# Altium schematic sheet STM32H745.SchDoc
size A
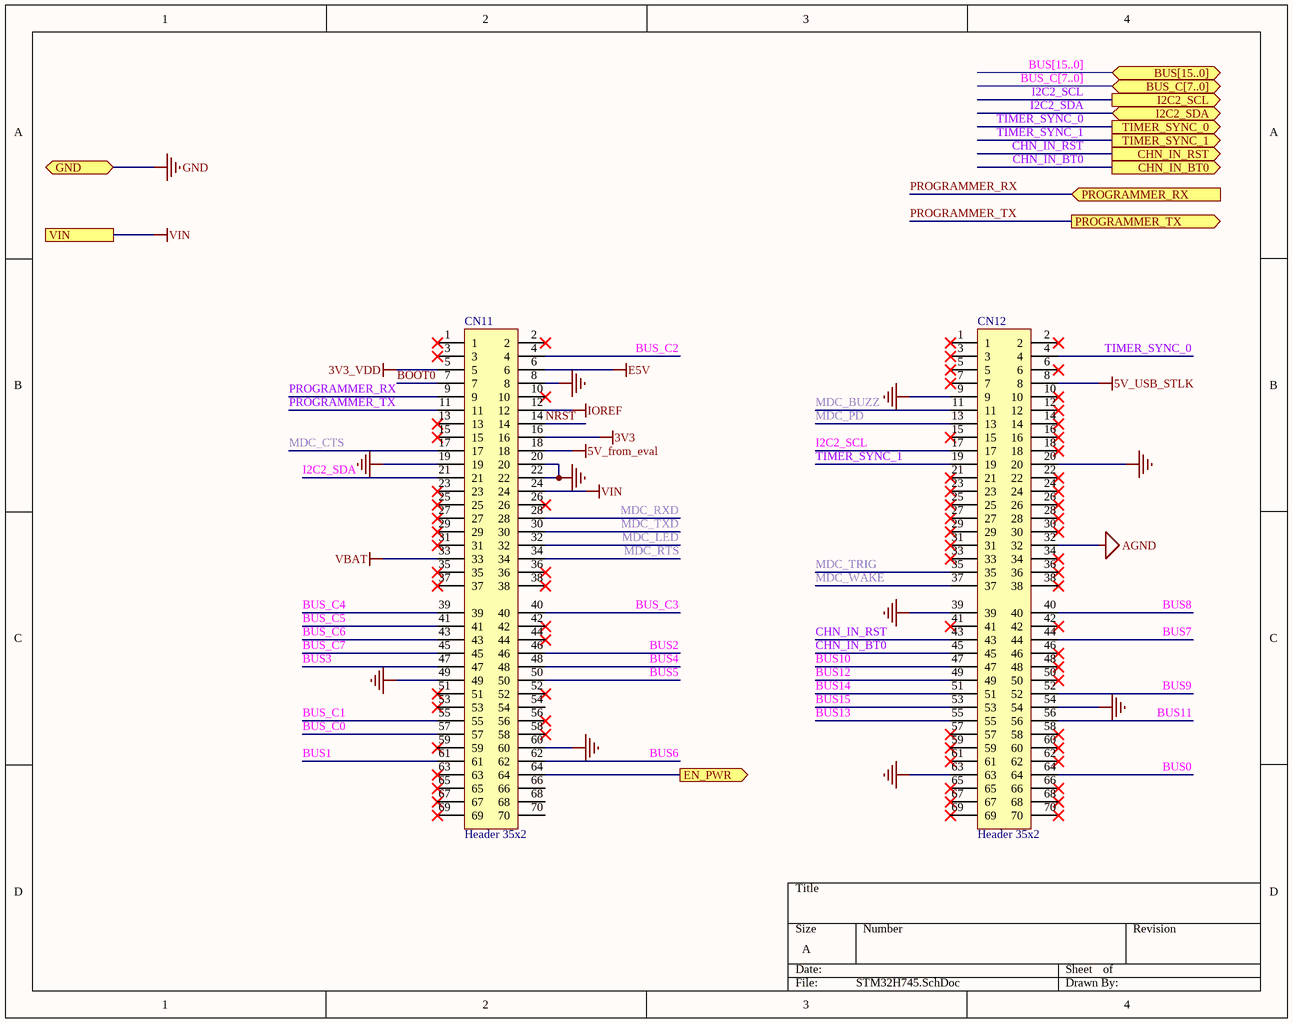
[diagram p0: STM32H745.SchDoc]

## Parts
CN11  Header 35x2  [HDR_2x36_2R54_V_M]
CN12  Header 35x2  [HDR_2x36_2R54_V_M]

## Ports
BUS[15..0] (bidir), BUS_C[7..0] (bidir), CHN_IN_BT0 (out), CHN_IN_RST (out), EN_PWR (out), GND (bidir), I2C2_SCL (out), I2C2_SDA (bidir), PROGRAMMER_RX (in), PROGRAMMER_TX (out), TIMER_SYNC_0 (out), TIMER_SYNC_1 (out), VIN

## Nets
3V3: CN11.16
3V3_VDD: CN11.5
5V_from_eval: CN11.18
5V_USB_STLK: CN12.8
AGND: CN12.32
E5V: CN11.6
GND: CN11.8 CN11.19 CN11.20 CN11.22 CN11.49 CN11.60 CN12.9 CN12.20 CN12.39 CN12.54 CN12.63 ; port GND
IOREF: CN11.12
VBAT: CN11.33
VIN: CN11.24 ; port VIN
BOOT0: CN11.7
BUS0: CN12.64
BUS1: CN11.61
BUS2: CN11.46
BUS3: CN11.47
BUS4: CN11.48
BUS5: CN11.50
BUS6: CN11.62
BUS7: CN12.44
BUS8: CN12.40
BUS9: CN12.52
BUS10: CN12.47
BUS11: CN12.56
BUS12: CN12.49
BUS13: CN12.55
BUS14: CN12.51
BUS15: CN12.53
BUS_C0: CN11.57
BUS_C1: CN11.55
BUS_C2: CN11.4
BUS_C3: CN11.40
BUS_C4: CN11.39
BUS_C5: CN11.41
BUS_C6: CN11.43
BUS_C7: CN11.45
CHN_IN_BT0: CN12.45 ; port CHN_IN_BT0
CHN_IN_RST: CN12.43 ; port CHN_IN_RST
EN_PWR: CN11.64 ; port EN_PWR
I2C2_SCL: CN12.17 ; port I2C2_SCL
I2C2_SDA: CN11.21 ; port I2C2_SDA
MDC_BUZZ: CN12.11
MDC_CTS: CN11.17
MDC_LED: CN11.32
MDC_PD: CN12.13
MDC_RTS: CN11.34
MDC_RXD: CN11.28
MDC_TRIG: CN12.35
MDC_TXD: CN11.30
MDC_WAKE: CN12.37
NRST: CN11.14
PROGRAMMER_RX: CN11.9 ; port PROGRAMMER_RX
PROGRAMMER_TX: CN11.11 ; port PROGRAMMER_TX
TIMER_SYNC_0: CN12.4 ; port TIMER_SYNC_0
TIMER_SYNC_1: CN12.19 ; port TIMER_SYNC_1

Not connected (* = marked no-connect by the designer): CN11 1* 2* 3* 10* 13* 15* 23* 25* 26* 27* 29* 31* 35* 36* 37* 38* 42* 44* 51* 52* 53* 54 56* 58* 59* 63* 65* 66 67* 68 69* 70; CN12 1* 2* 3* 5* 6* 7* 10* 12* 14* 15* 16* 18* 21* 22* 23* 24* 25* 26* 27* 28* 29* 30* 31* 33* 34* 36* 38* 41* 42* 46* 48* 50* 57* 58* 59* 60* 61* 62* 65* 66* 67* 68* 69* 70*

## Buses and harness runs
bus BUS[15..0] = port BUS[15..0]
bus BUS_C[7..0] = port BUS_C[7..0]

## Library data of the parts
CN11 CN12 = MCD-01210: Header, 35x2, 2,54mm, VR, TH, Height 5.84mm/2.54mm; Parameter 1: 929975E-01-36-ND; ComponentLink1Description: digikey; ComponentLink1URL: https://www.digikey.com/en/products/detail/929975-01-36-RK/929975E-01-36-ND/1094325?itemSeq=354777972